# Altium project TS_24 Temperature Module.PrjPcb
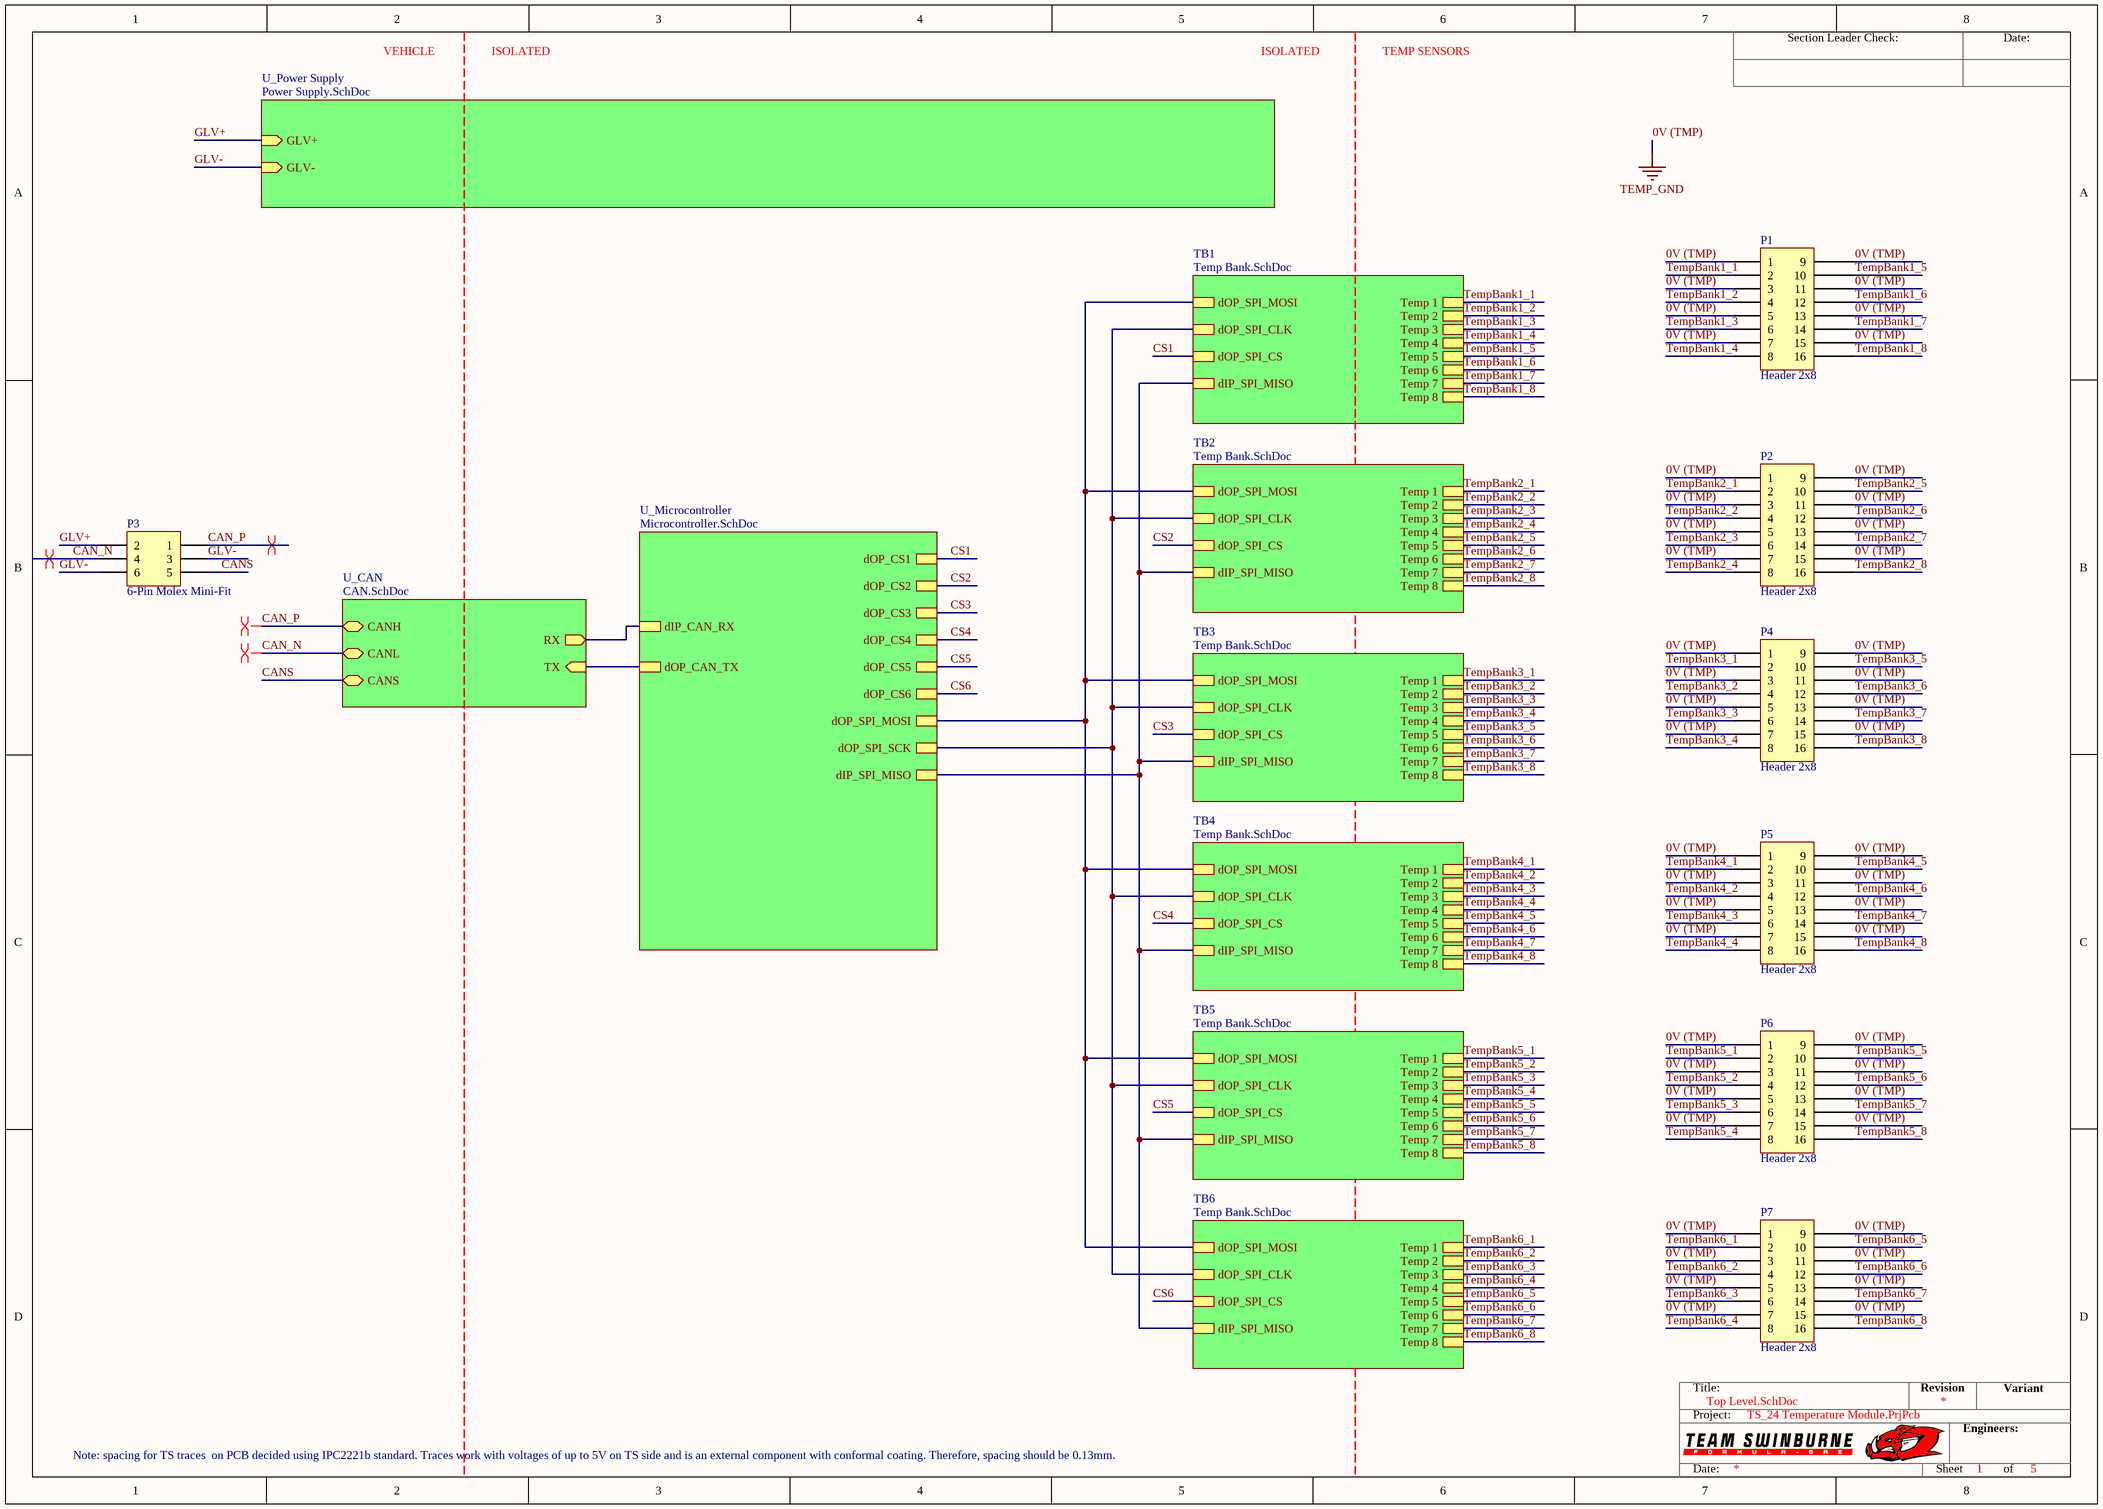
[diagram p0: Top Level.SchDoc]
5 sheets, 273 parts. Net scope: hierarchical (ports join the sheet entries above them; power ports are global).
Board file: Temp Module B1 Sample.PcbDoc
Sheets:
  Top Level.SchDoc
    U_Power Supply = Power Supply.SchDoc
    U_CAN = CAN.SchDoc
    U_Microcontroller = Microcontroller.SchDoc
    TB1 = Temp Bank.SchDoc
    TB2 = Temp Bank.SchDoc
    TB3 = Temp Bank.SchDoc
    TB4 = Temp Bank.SchDoc
    TB5 = Temp Bank.SchDoc
    TB6 = Temp Bank.SchDoc

## Sheet Top Level.SchDoc
size A3; SheetNumber: 1; SheetTotal: 5

### Parts
P1  Header 2x8  [B16B-PHDSS]
P2  Header 2x8  [B16B-PHDSS]
P3  6-Pin Molex Mini-Fit  [6-Pin Molex Mini-Fit]
P4  Header 2x8  [B16B-PHDSS]
P5  Header 2x8  [B16B-PHDSS]
P6  Header 2x8  [B16B-PHDSS]
P7  Header 2x8  [B16B-PHDSS]

### Sub-sheets
TB1 = Temp Bank.SchDoc: dOP_SPI_MOSI, dOP_SPI_CLK, dOP_SPI_CS, dIP_SPI_MISO, Temp 4, Temp 5, Temp 6, Temp 1, Temp 2, Temp 3, Temp 7, Temp 8
TB2 = Temp Bank.SchDoc: dOP_SPI_MOSI, dOP_SPI_CLK, dOP_SPI_CS, dIP_SPI_MISO, Temp 1, Temp 2, Temp 3, Temp 4, Temp 5, Temp 6, Temp 7, Temp 8
TB3 = Temp Bank.SchDoc: dOP_SPI_MOSI, dOP_SPI_CLK, dOP_SPI_CS, dIP_SPI_MISO, Temp 1, Temp 2, Temp 3, Temp 4, Temp 5, Temp 6, Temp 7, Temp 8
TB4 = Temp Bank.SchDoc: dOP_SPI_MOSI, dOP_SPI_CLK, dOP_SPI_CS, dIP_SPI_MISO, Temp 1, Temp 2, Temp 3, Temp 4, Temp 5, Temp 6, Temp 7, Temp 8
TB5 = Temp Bank.SchDoc: dOP_SPI_MOSI, dOP_SPI_CLK, dOP_SPI_CS, dIP_SPI_MISO, Temp 1, Temp 2, Temp 3, Temp 4, Temp 5, Temp 6, Temp 7, Temp 8
TB6 = Temp Bank.SchDoc: dOP_SPI_MOSI, dOP_SPI_CLK, dOP_SPI_CS, dIP_SPI_MISO, Temp 1, Temp 2, Temp 3, Temp 4, Temp 5, Temp 6, Temp 7, Temp 8
U_CAN = CAN.SchDoc: CANH (bidir), RX (out), TX (in), CANL (bidir), CANS (bidir)
U_Microcontroller = Microcontroller.SchDoc: dOP_CS1, dOP_CS2, dOP_CS3, dOP_CS4, dOP_CS5, dOP_SPI_MOSI, dOP_CS6, dOP_SPI_SCK, dIP_CAN_RX, dOP_CAN_TX, dIP_SPI_MISO
U_Power Supply = Power Supply.SchDoc: GLV+ (in), GLV- (in)

### Nets
0V (TMP): P1.1 P1.3 P1.5 P1.7 P1.9 P1.11 P1.13 P1.15 P2.1 P2.3 P2.5 P2.7 P2.9 P2.11 P2.13 P2.15 P4.1 P4.3 P4.5 P4.7 P4.9 P4.11 P4.13 P4.15 P5.1 P5.3 P5.5 P5.7 P5.9 P5.11 P5.13 P5.15 P6.1 P6.3 P6.5 P6.7 P6.9 P6.11 P6.13 P6.15 P7.1 P7.3 P7.5 P7.7 P7.9 P7.11 P7.13 P7.15  [also labelled TEMP_GND]
CAN_N: P3.4 ; sheet U_CAN/CANL
CAN_P: P3.1 ; sheet U_CAN/CANH
CANS: P3.5 ; sheet U_CAN/CANS
CS1: sheet U_Microcontroller/dOP_CS1, sheet TB1/dOP_SPI_CS
CS2: sheet U_Microcontroller/dOP_CS2, sheet TB2/dOP_SPI_CS
CS3: sheet U_Microcontroller/dOP_CS3, sheet TB3/dOP_SPI_CS
CS4: sheet U_Microcontroller/dOP_CS4, sheet TB4/dOP_SPI_CS
CS5: sheet U_Microcontroller/dOP_CS5, sheet TB5/dOP_SPI_CS
CS6: sheet U_Microcontroller/dOP_CS6, sheet TB6/dOP_SPI_CS
GLV+: P3.2 ; sheet U_Power Supply/GLV+
GLV-: P3.3 P3.6 ; sheet U_Power Supply/GLV-
TempBank1_1: P1.2 ; sheet TB1/Temp 1
TempBank1_2: P1.4 ; sheet TB1/Temp 2
TempBank1_3: P1.6 ; sheet TB1/Temp 3
TempBank1_4: P1.8 ; sheet TB1/Temp 4
TempBank1_5: P1.10 ; sheet TB1/Temp 5
TempBank1_6: P1.12 ; sheet TB1/Temp 6
TempBank1_7: P1.14 ; sheet TB1/Temp 7
TempBank1_8: P1.16 ; sheet TB1/Temp 8
TempBank2_1: P2.2 ; sheet TB2/Temp 1
TempBank2_2: P2.4 ; sheet TB2/Temp 2
TempBank2_3: P2.6 ; sheet TB2/Temp 3
TempBank2_4: P2.8 ; sheet TB2/Temp 4
TempBank2_5: P2.10 ; sheet TB2/Temp 5
TempBank2_6: P2.12 ; sheet TB2/Temp 6
TempBank2_7: P2.14 ; sheet TB2/Temp 7
TempBank2_8: P2.16 ; sheet TB2/Temp 8
TempBank3_1: P4.2 ; sheet TB3/Temp 1
TempBank3_2: P4.4 ; sheet TB3/Temp 2
TempBank3_3: P4.6 ; sheet TB3/Temp 3
TempBank3_4: P4.8 ; sheet TB3/Temp 4
TempBank3_5: P4.10 ; sheet TB3/Temp 5
TempBank3_6: P4.12 ; sheet TB3/Temp 6
TempBank3_7: P4.14 ; sheet TB3/Temp 7
TempBank3_8: P4.16 ; sheet TB3/Temp 8
TempBank4_1: P5.2 ; sheet TB4/Temp 1
TempBank4_2: P5.4 ; sheet TB4/Temp 2
TempBank4_3: P5.6 ; sheet TB4/Temp 3
TempBank4_4: P5.8 ; sheet TB4/Temp 4
TempBank4_5: P5.10 ; sheet TB4/Temp 5
TempBank4_6: P5.12 ; sheet TB4/Temp 6
TempBank4_7: P5.14 ; sheet TB4/Temp 7
TempBank4_8: P5.16 ; sheet TB4/Temp 8
TempBank5_1: P6.2 ; sheet TB5/Temp 1
TempBank5_2: P6.4 ; sheet TB5/Temp 2
TempBank5_3: P6.6 ; sheet TB5/Temp 3
TempBank5_4: P6.8 ; sheet TB5/Temp 4
TempBank5_5: P6.10 ; sheet TB5/Temp 5
TempBank5_6: P6.12 ; sheet TB5/Temp 6
TempBank5_7: P6.14 ; sheet TB5/Temp 7
TempBank5_8: P6.16 ; sheet TB5/Temp 8
TempBank6_1: P7.2 ; sheet TB6/Temp 1
TempBank6_2: P7.4 ; sheet TB6/Temp 2
TempBank6_3: P7.6 ; sheet TB6/Temp 3
TempBank6_4: P7.8 ; sheet TB6/Temp 4
TempBank6_5: P7.10 ; sheet TB6/Temp 5
TempBank6_6: P7.12 ; sheet TB6/Temp 6
TempBank6_7: P7.14 ; sheet TB6/Temp 7
TempBank6_8: P7.16 ; sheet TB6/Temp 8
NetD4_TB1_K: sheet U_Microcontroller/dIP_SPI_MISO, sheet TB1/dIP_SPI_MISO, sheet TB2/dIP_SPI_MISO, sheet TB3/dIP_SPI_MISO, sheet TB4/dIP_SPI_MISO, sheet TB5/dIP_SPI_MISO, sheet TB6/dIP_SPI_MISO
NetR2_2: sheet U_Microcontroller/dOP_SPI_MOSI, sheet TB1/dOP_SPI_MOSI, sheet TB2/dOP_SPI_MOSI, sheet TB3/dOP_SPI_MOSI, sheet TB4/dOP_SPI_MOSI, sheet TB5/dOP_SPI_MOSI, sheet TB6/dOP_SPI_MOSI
NetR4_2: sheet U_Microcontroller/dOP_SPI_SCK, sheet TB1/dOP_SPI_CLK, sheet TB2/dOP_SPI_CLK, sheet TB3/dOP_SPI_CLK, sheet TB4/dOP_SPI_CLK, sheet TB5/dOP_SPI_CLK, sheet TB6/dOP_SPI_CLK
NetR29_1: sheet U_CAN/RX, sheet U_Microcontroller/dIP_CAN_RX
NetR30_1: sheet U_CAN/TX, sheet U_Microcontroller/dOP_CAN_TX

### Layout directives
differential pair: CAN_N, CAN_P

### Notes on the sheet
- VEHICLE
- ISOLATED
- TEMP SENSORS
- Note: spacing for TS traces  on PCB decided using IPC2221b standard. Traces work with voltages of up to 5V on TS side and is an external component with conformal coating. Therefore, spacing should be 0.13mm.
- Section Leader Check:
- Date:
- Title:
- Revision
- Variant
- Project:
- Engineers:
- Sheet
- of

### Library data of the parts
P1 P2 P4-P7 = B16B-PHDSS: Positions: 16; Pitch: 2.00mm; Angle: 0; Flange: No; Contact: Tin; Part Number: B16B-PHDSS; Row Spacing: 2.00mm
P3 = CMP-CONN-0004-1: 6-Pin Molex Mini-Fit Connector Header 6 pin mini fit

## Sheet Power Supply.SchDoc
size A4; SheetNumber: 2; SheetTotal: 5
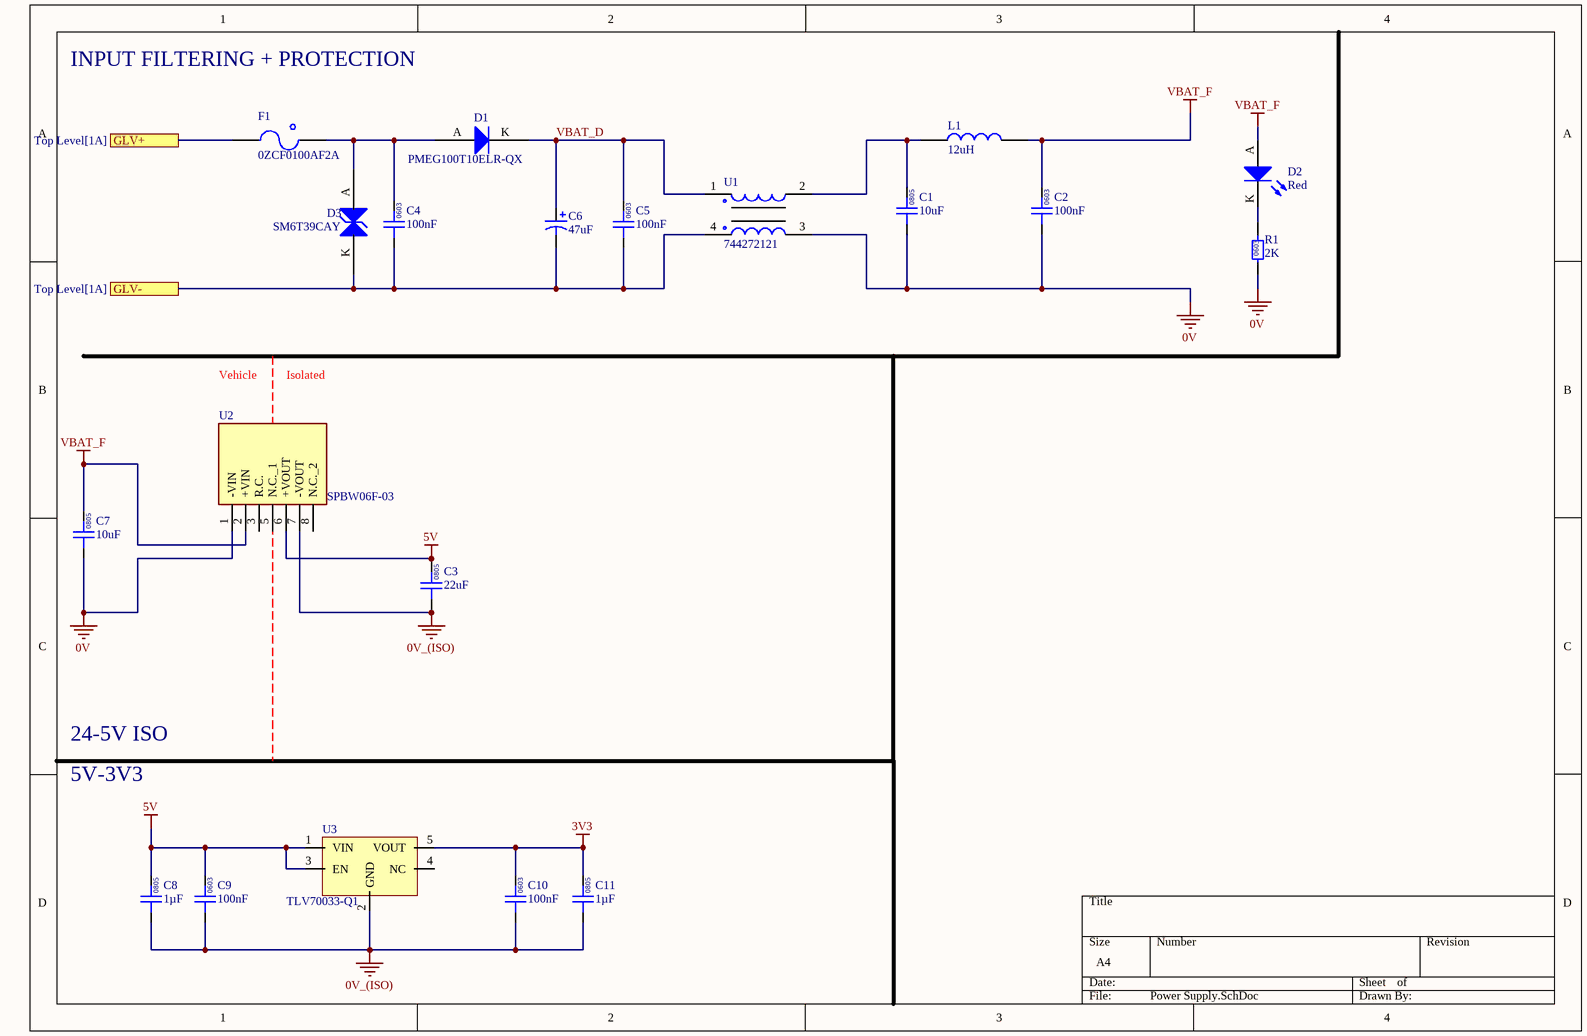
[diagram p1: Power Supply.SchDoc]

### Parts
C1  10uF  [0805]
C2  100nF  [0603]
C3  22uF  [0805]
C4  100nF  [0603]
C5  100nF  [0603]
C6  47uF  [CHEMI-CON ELCO]
C7  10uF  [0805]
C8  1µF  [0805]
C9  100nF  [0603]
C10  100nF  [0603]
C11  1µF  [0805]
D1  PMEG100T10ELR-QX  [SODFL350X110-2N]
D2  Red  [0805 LED]
D3  SM6T39CAY  [SM6T39CAY-Footprint-1]
F1  0ZCF0100AF2A  [2920]
L1  12uH  [1812]
R1  2K  [0603]
U1  744272121  [Wurth 4-PC Pad]
U2  SPBW06F-03  [SPBW06F03]
U3  TLV70033-Q1  [TI SOT-23-5]

### Ports
GLV+ (see Top Level[1A]), GLV- (see Top Level[1A])

### Nets
0V: C1.1 C2.1 C7.1 R1.1 U1.3 U2.1(-VIN)
0V_(ISO): C3.1 C8.1 C9.1 C10.1 C11.1 U2.7(-VOUT) U3.2(GND)
3V3: C10.2 C11.2 U3.5(VOUT)
5V: C3.2 C8.2 C9.2 U2.6(+VOUT) U3.1(VIN) U3.3(EN)
VBAT_F: C2.2 C7.2 D2.A L1.1 U2.2(+VIN)
GLV+: F1.1 ; port GLV+
GLV-: C4.1 C5.1 C6.1 D3.K U1.4 ; port GLV-
VBAT_D: C5.2 C6.2 D1.K U1.1
NetC1_2: C1.2 L1.2 U1.2
NetC4_2: C4.2 D1.A D3.A F1.2
NetD2_K: D2.K R1.2

Not connected (* = marked no-connect by the designer): U2 3(R.C.) 5(N.C._1) 8(N.C._2); U3 4(NC)

### Notes on the sheet
- INPUT FILTERING + PROTECTION
- Vehicle
- Isolated
- 24-5V ISO
- 5V-3V3
- (in symbol GCM21BR71H105KA03L) 0805
- (in symbol GCM188L81H104KA57D) 0603
- (in symbol GRM21BR6YA106KE43L) 0805
- (in symbol GRM21BR61A226ME51L) 0805
- (in symbol RC0603FR-072KL) 0603

### Library data of the parts
C1 C7 = GRM21BR6YA106KE43L: Manufacturer: muRata; Rated Voltage: 50V; Tolerance: 10%; Material: MLCC; Temperature Rating: X5R; Part Number: GRM21BR6YA106KE43L; Value: 10uF; Digikey Part Number: 490-10514-6-ND
C2 C4 C5 C9 C10 = GCM188L81H104KA57D: Manufacturer: muRata; Rated Voltage: 50V; Tolerance: ±10%; Material: MLCC; Temperature Rating: X8L; Part Number: GCM188L81H104KA57D; Value: 100nF; Digikey Part Number: 490-6049-1-ND
C3 = GRM21BR61A226ME51L: Manufacturer: muRata; Rated Voltage: 10V; Tolerance: 20%; Material: MLCC; Temperature Rating: X5R; Part Number: GRM21BR61A226ME51L; Value: 22uF; Digikey Part Number: 490-10511-1-ND
C6 = HHXA350ARA470MF61G: Part Number: HHXA350ARA470MF61G
C8 C11 = GCM21BR71H105KA03L: Manufacturer: muRata; Rated Voltage: 50V; Tolerance: ±10%; Material: MLCC; Temperature Rating: X7R; Part Number: GCM21BR71H105KA03L; Value: 1µF; Digikey Part Number: 490-10675-1-ND
D1 = CMP-004-00005-4: Diode 100 V 1A Surface Mount SOD-123W
D2 = SML-210LTT86: Red LED Indication - Discrete 1.75V 0805 (2012 Metric); Manufacturer: ROHM Semiconductor; Part Number: SML-210LTT86; Colour: Red; Digikey Part Number: 511-1286-1-ND
D3 = CMP-004-00003-4: TVS Diode Single Bi-Dir 33.3V 600W Automotive 2-Pin SMB T/R / TVS DIODE 33.3VWM 69.7VC SMB; Peak Pulse Current: 57A; Polarity: Bidirectional; Min Breakdown Voltage: 37.1V; Test Current: 1mA; Number of Elements: 1; Operating Supply Voltage: 30V; Diode Type: ZENER; Clamping Voltage: 53.9V; Leakage Current: 200nA; Power Line Protection: No; Max Surge Current: 11.1A; Max Breakdown Voltage: 41V; Breakdown Voltage: 39V; Max Power Dissipation: 600W; Radiation Hardening: No; Resistor Type: Zener; Termination: SMD/SMT; REACH SVHC: No SVHC; Reverse Breakdown Voltage: 37.1V; Max Operating Temperature: 150°C; Min Operating Temperature: -55°C; Element Configuration: Single; Length: 4.6mm; Case/Package: DO-214AA; Reverse Standoff Voltage: 33.3V; Number of Bidirectional Channels: 1; Number of Pins: 2; Direction: Bidirectional; Mount: Surface Mount; Package Quantity: 1; Width: 3.95mm; RoHS Compliant: Yes; Number of Channels: 1; Packaging: Tape and Reel; Max Reverse Leakage Current: 200nA; Peak Pulse Power: 600W; Height: 2.45mm; Series: Automotive, AEC-Q101, SM6TY, TRANSIL™
F1 = 0ZCF0100AF2A: PTC RESET FUSE 60V 1A 292; Manufacturer: Littelfuse Inc.; Part Number: 0ZCF0100AF2A; Digikey Part Number: 507-2070-1-ND; Digikey Link: https://www.digikey.com/product-detail/en/bel-fuse-inc/0ZCF0100AF2A/507-2070-1-ND/6210547
L1 = RLS-126: Manufacturer: Recom; Tolerance: 0.2; Impedance: 230mOhm; Rated Current: 0.8 A; Material: Wirewound; Part Number: RLS-126; Value: 12uH; Digikey Part Number: 945-3429-ND
R1 = RC0603FR-072KL: Manufacturer: YAGEO; Tolerance: 0.01; Rated Power: 0.1W; Part Number: RC0603FR-072KL; Value: 2K; Digikey Part Number: 311-2.00KHRCT-ND; Material: FR-07
U1 = 744272121: Manufacturer: Wurth Electronics Inc; Value: 120uH @ 100kHz; Impedance: 460 Ohms @ 30MHz; Rated Current: 2.5 A; Part Number: 744272121; Material: Wirewound; Digikey Part Number: 732-1489-1-ND
U2 = SPBW06F-03: Power Supply; Manufacturer_Name: Mean Well; Datasheet Link: https://www.arrow.com/en/products/spbw06f-03/mean-well-enterprises; Height: 11.1mm; Manufacturer_Part_Number: SPBW06F-03; Mouser Part Number: 709-SPBW06F-03; Mouser Price/Stock: https://www.mouser.co.uk/ProductDetail/MEAN-WELL/SPBW06F-03?qs=5aG0NVq1C4z4PI70qr7ycg%3D%3D; Arrow Part Number: SPBW06F-03; Arrow Price/Stock: https://www.arrow.com/en/products/spbw06f-03/mean-well-enterprises?region=nac
U3 = TLV70033-Q1: IC REG LINEAR 3.3V 200MA SOT23-5; Manufacturer: Texas Instruments; Input Voltage: 2 to 5.5 V; Output Current: 0.2 A; Part Number: TLV70033-Q1; Output Voltage: 3.3 V; Digikey Part Number: 296-27780-1-ND

## Sheet CAN.SchDoc
size A4; SheetNumber: 4; SheetTotal: 5
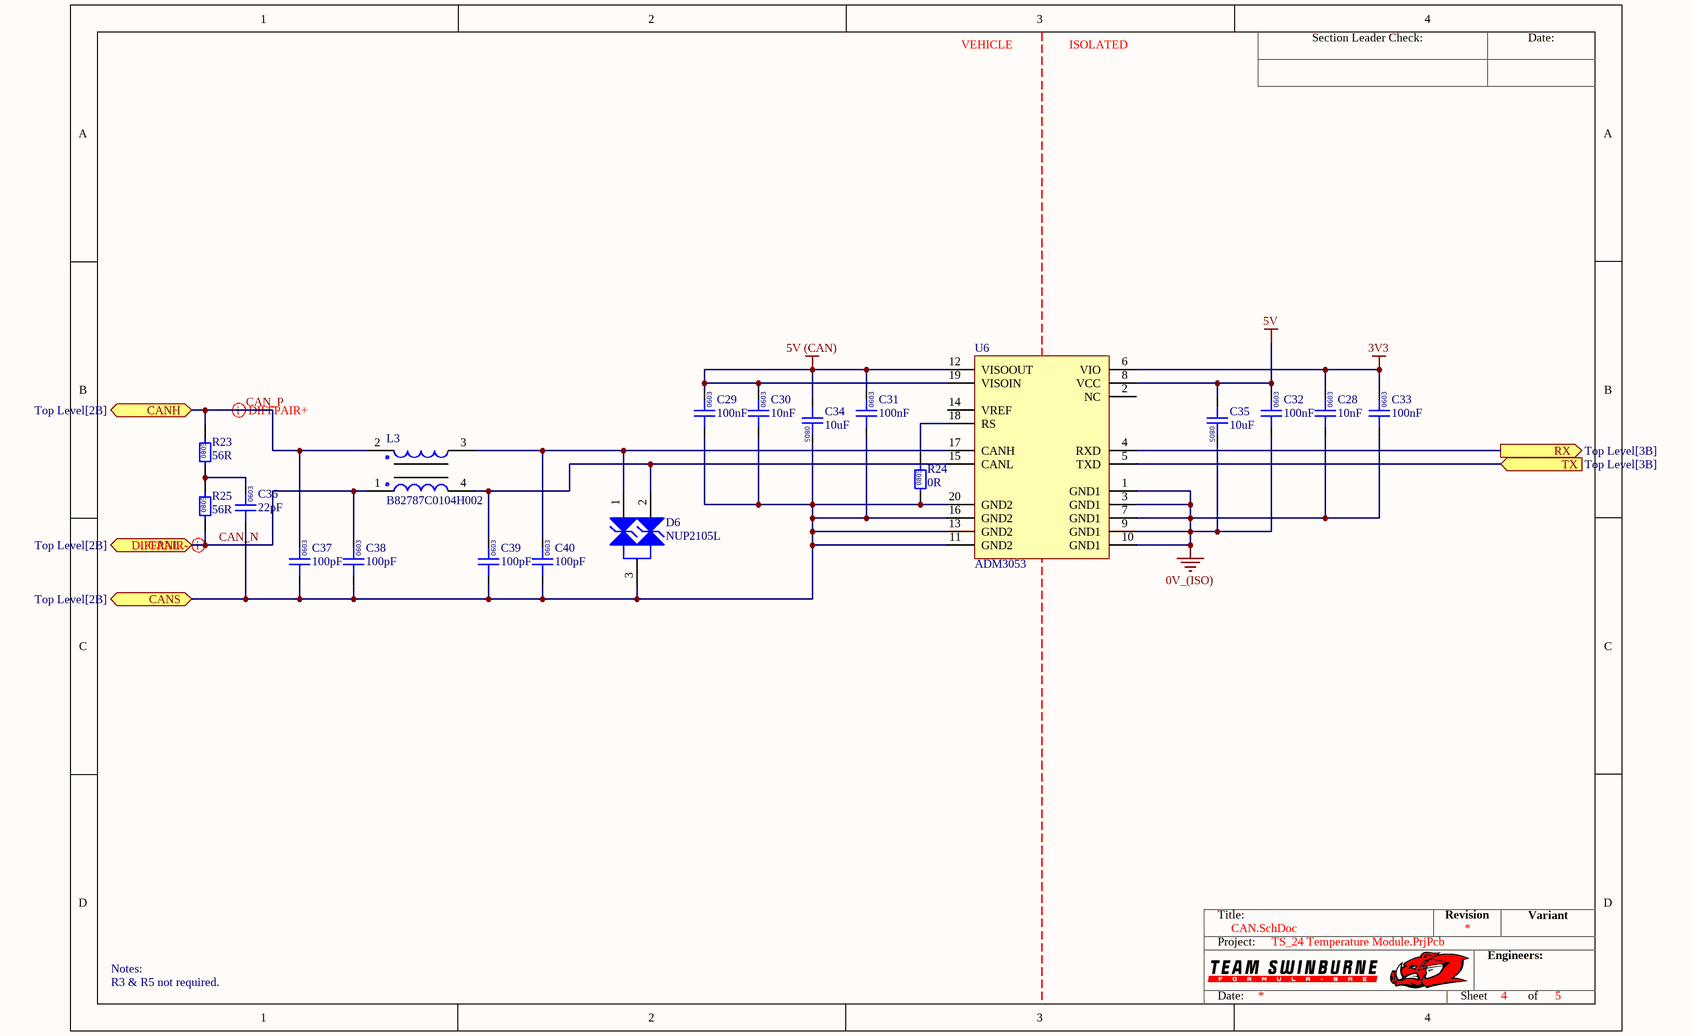
[diagram p2: CAN.SchDoc]

### Parts
C28  10nF  [0603]
C29  100nF  [0603]
C30  10nF  [0603]
C31  100nF  [0603]
C32  100nF  [0603]
C33  100nF  [0603]
C34  10uF  [0805]
C35  10uF  [0805]
C36  22pF  [0603]
C37  100pF  [0603]
C38  100pF  [0603]
C39  100pF  [0603]
C40  100pF  [0603]
D6  NUP2105L  [ONSC-SOT-23-3-318-08_V]
L3  B82787C0104H002  [TDK 4-PC Pad]
R23  56R  [0805]
R24  0R  [0805]
R25  56R  [0805]
U6  ADM3053  [AD SOIC-W 20]

### Ports
CANH (bidir, see Top Level[2B]), CANL (bidir, see Top Level[2B]), CANS (bidir, see Top Level[2B]), RX (out, see Top Level[3B]), TX (in, see Top Level[3B])

### Nets
0V_(ISO): C28.1 C32.1 C33.1 C35.2 U6.1(GND1) U6.3(GND1) U6.7(GND1) U6.9(GND1) U6.10(GND1)
3V3: C28.2 C33.2 U6.6(VIO)
5V: C32.2 C35.1 U6.8(VCC)
5V (CAN): C29.2 C30.2 C31.2 C34.1 U6.12(VISOOUT) U6.19(VISOIN)
CAN_N: C38.2 L3.1 R25.1 ; port CANL
CAN_P: C37.2 L3.2 R23.2 ; port CANH
CANS: C29.1 C30.1 C31.1 C34.2 C36.1 C37.1 C38.1 C39.1 C40.1 D6.3(K) R24.1 U6.11(GND2) U6.13(GND2) U6.16(GND2) U6.20(GND2) ; port CANS
NetC36_2: C36.2 R23.1 R25.2
NetC39_2: C39.2 D6.2(K) L3.4 U6.15(CANL)
NetC40_2: C40.2 D6.1(K) L3.3 U6.17(CANH)
NetR24_2: R24.2 U6.18(RS)
NetR29_1: U6.4(RXD) ; port RX
NetR30_1: U6.5(TXD) ; port TX

Not connected (* = marked no-connect by the designer): U6 2(NC) 14(VREF)

### Layout directives
differential pair: CAN_N, CAN_P

### Notes on the sheet
- VEHICLE
- ISOLATED
- Notes:
- R3 & R5 not required.
- Section Leader Check:
- Date:
- Title:
- Revision
- Variant
- Project:
- Engineers:
- Sheet
- of
- (in symbol GCM188L81H103KA03D) 0603
- (in symbol GCM188L81H104KA57D) 0603
- (in symbol GRM21BR6YA106KE43L) 0805
- (in symbol GRM0335C1H220JA01D) 0603
- (in symbol GRM1885C1H101JA01D) 0603
- (in symbol RC0805FR070RL) 0805
- (in symbol RC0805FR0756RL) 0805

### Library data of the parts
C28 C30 = GCM188L81H103KA03D: Manufacturer: muRata; Rated Voltage: 50V; Tolerance: ±10%; Material: MLCC; Temperature Rating: X8L; Part Number: GCM188L81H103KA03D; Value: 10nF; Digikey Part Number: 490-GCM188L81H103KA03DCT-ND
C29 C31-C33 = GCM188L81H104KA57D: as C2 on sheet Power Supply; Part Number: GCM188L81H104KA57D; Value: 100nF; Digikey Part Number: 490-6049-1-ND
C34 C35 = GRM21BR6YA106KE43L: as C1 on sheet Power Supply; Part Number: GRM21BR6YA106KE43L; Value: 10uF; Digikey Part Number: 490-10514-6-ND
C36 = GRM0335C1H220JA01D: Manufacturer: Murata Electronics; Rated Voltage: 50V; Tolerance: ±5%; Material: MLCC; Temperature Rating: C0G, NP0; Part Number: GRM0335C1H220JA01D; Value: 22pF; Digikey Part Number: 490-6123-1-ND
C37-C40 = GRM1885C1H101JA01D: Manufacturer: Murata Electronics; Rated Voltage: 50V; Tolerance: ±5%; Material: MLCC; Temperature Rating: C0G, NP0; Part Number: GRM1885C1H101JA01D; Value: 100pF; Digikey Part Number: 490-1427-1-ND
D6 = CMP-004-00000-1: NUP2105L Series 350 W Dual Line CAN Bus Protector ESD Protection Diode - SOT-23; Max Breakdown Voltage: 32V; Clamping Voltage: 44V; Number of Lines: 2; Direction: Bidirectional; Reverse Standoff Voltage: 24V; Min Breakdown Voltage: 26.2V; Peak Pulse Current: 8A; ESD Protection: Yes; Test Current: 1mA; Diode Type: ZENER; Max Power Dissipation: 350W; Capacitance: 30pF; Leakage Current: 100nA; Power Line Protection: No; Depth: 1.3mm; Package Quantity: 1; Element Configuration: Dual; Termination: SMD/SMT; Radiation Hardening: No; Min Operating Temperature: -55°C; Contact Plating: Tin,Matte; Packaging: Tape and Reel; Polarity: Bidirectional; Resistor Type: Zener; Clamping Voltage-Max: 44V; Height: 0.94mm; Max Surge Current: 8A; RoHS Compliant: Yes; Width: 1.3mm; Lead Free: Lead Free; Case/Package: SOT-23-3; Number of Channels: 2; Series: Automotive, AEC-Q101; Halogen Free: Halogen Free; Breakdown Voltage: 26.2V; Working Voltage: 24V; Operating Supply Voltage: 24V; Max Operating Temperature: 150°C; REACH SVHC: No SVHC; Number of Pins: 3; Max Reverse Leakage Current: 100nA; Peak Pulse Power: 350W; Length: 2.9mm; Number of Bidirectional Channels: 2
L3 = B82787C0104H002: Manufacturer: EPCOS (TDK); Value: 100µH @ 100kHz; Impedance: 5.8 kOhms @ 10MHz; Rated Current: 150mA; Material: Wirewound; Part Number: B82787C0104H002; Digikey Part Number: 495-4598-1-ND
R23 R25 = RC0805FR0756RL: Manufacturer: YAGEO; Tolerance: 0.01; Rated Power: 0.125W; Part Number: RC0805FR0756RL; Value: 56R; Material: FR-07; Digikey Part Number: 311-56.0CRCT-ND
R24 = RC0805FR070RL: Manufacturer: YAGEO; Tolerance: 0.01; Rated Power: 0.125W; Part Number: RC0805FR070RL; Value: 0R; Material: FR-07; Digikey Part Number: 311-0.0CRCT-ND
U6 = ADM3053: Isolated CAN Transceiver; Manufacturer: Analogue Devices; Part Number: ADM3053; Digikey Part Number: ADM3053BRWZ-ND; Digikey Link: https://www.digikey.com/product-detail/en/analog-devices-inc/ADM3053BRWZ/ADM3053BRWZ-ND/2709332

## Sheet Microcontroller.SchDoc
size A4; SheetNumber: 5; SheetTotal: 5
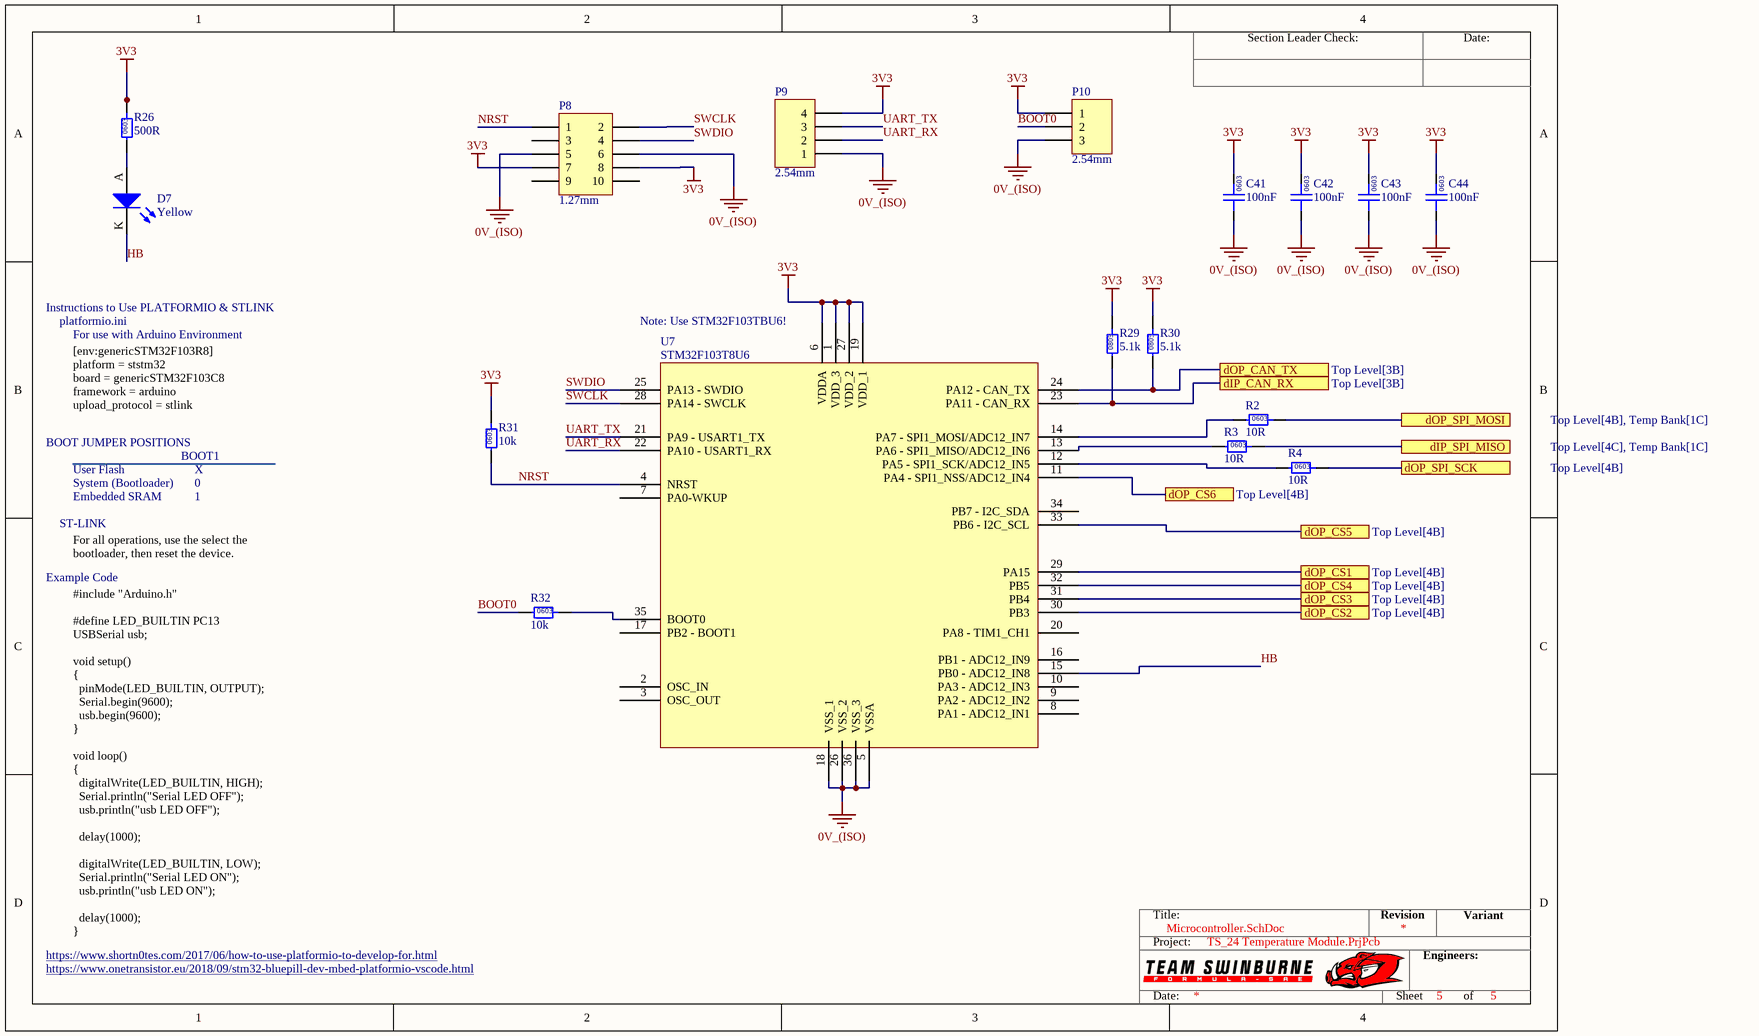
[diagram p3: Microcontroller.SchDoc]

### Parts
C41  100nF  [0603]
C42  100nF  [0603]
C43  100nF  [0603]
C44  100nF  [0603]
D7  Yellow  [0805 LED]
P8  1.27mm  [3221-10-0300-00]
P9  2.54mm  [TH 2.54mm Header 1x4]
P10  2.54mm  [TH 2.54mm Header 1x3]
R2  10R  [0603]
R3  10R  [0603]
R4  10R  [0603]
R26  500R  [0603]
R29  5.1k  [0805]
R30  5.1k  [0805]
R31  10k  [0603]
R32  10k  [0603]
U7  STM32F103T8U6  [STM_QFN-36]

### Ports
dIP_CAN_RX (see Top Level[3B]), dIP_SPI_MISO (see Top Level[4C], Temp Bank[1C]), dOP_CAN_TX (see Top Level[3B]), dOP_CS1 (see Top Level[4B]), dOP_CS2 (see Top Level[4B]), dOP_CS3 (see Top Level[4B]), dOP_CS4 (see Top Level[4B]), dOP_CS5 (see Top Level[4B]), dOP_CS6 (see Top Level[4B]), dOP_SPI_MOSI (see Top Level[4B], Temp Bank[1C]), dOP_SPI_SCK (see Top Level[4B])

### Nets
0V_(ISO): C41.1 C42.1 C43.1 C44.1 P8.5 P8.6 P9.1 P10.3 U7.5(VSSA) U7.18(VSS_1) U7.26(VSS_2) U7.36(VSS_3)
3V3: C41.2 C42.2 C43.2 C44.2 P8.7 P8.8 P9.4 P10.1 R26.2 R29.2 R30.2 R31.2 U7.1(VDD_3) U7.6(VDDA) U7.19(VDD_1) U7.27(VDD_2)
BOOT0: P10.2 R32.1
CS1: U7.29(PA15) ; port dOP_CS1
CS2: U7.30(PB3) ; port dOP_CS2
CS3: U7.31(PB4) ; port dOP_CS3
CS4: U7.32(PB5) ; port dOP_CS4
CS5: U7.33(PB6_-_I2C_SCL) ; port dOP_CS5
CS6: U7.11(PA4_-_SPI1_NSS/ADC12_IN4) ; port dOP_CS6
HB: D7.K U7.15(PB0_-_ADC12_IN8)
NRST: P8.1 R31.1 U7.4(NRST)
SWCLK: P8.2 U7.28(PA14_-_SWCLK)
SWDIO: P8.4 U7.25(PA13_-_SWDIO)
UART_RX: P9.2 U7.22(PA10_-_USART1_RX)
UART_TX: P9.3 U7.21(PA9_-_USART1_TX)
NetD4_TB1_K: R3.2 ; port dIP_SPI_MISO
NetD7_A: D7.A R26.1
NetR2_1: R2.1 U7.14(PA7_-_SPI1_MOSI/ADC12_IN7)
NetR2_2: R2.2 ; port dOP_SPI_MOSI
NetR3_1: R3.1 U7.13(PA6_-_SPI1_MISO/ADC12_IN6)
NetR4_1: R4.1 U7.12(PA5_-_SPI1_SCK/ADC12_IN5)
NetR4_2: R4.2 ; port dOP_SPI_SCK
NetR29_1: R29.1 U7.23(PA11_-_CAN_RX) ; port dIP_CAN_RX
NetR30_1: R30.1 U7.24(PA12_-_CAN_TX) ; port dOP_CAN_TX
NetR32_2: R32.2 U7.35(BOOT0)

Not connected (* = marked no-connect by the designer): P8 3 9 10; U7 2(OSC_IN) 3(OSC_OUT) 7(PA0-WKUP) 8(PA1_-_ADC12_IN1) 9(PA2_-_ADC12_IN2) 10(PA3_-_ADC12_IN3) 16(PB1_-_ADC12_IN9) 17(PB2_-_BOOT1_) 20(PA8_-_TIM1_CH1) 34(PB7_-_I2C_SDA)

### Notes on the sheet
- Instructions to Use PLATFORMIO & STLINK
- platformio.ini
- For use with Arduino Environment
- (near U7) Note: Use STM32F103TBU6!
- BOOT JUMPER POSITIONS
- [env:genericSTM32F103R8]
  platform = ststm32
  board = genericSTM32F103C8
  framework = arduino
  upload_protocol = stlink
- User Flash
- System (Bootloader)
- Embedded SRAM
- BOOT1
- X
- 1
- 0
- Example Code
- ST-LINK
- For all operations, use the select the bootloader, then reset the device.
- https://www.shortn0tes.com/2017/06/how-to-use-platformio-to-develop-for.html
- https://www.onetransistor.eu/2018/09/stm32-bluepill-dev-mbed-platformio-vscode.html
- #include "Arduino.h"
  #define LED_BUILTIN PC13
  USBSerial usb;
  void setup()
  {
  pinMode(LED_BUILTIN, OUTPUT);
  Serial.begin(9600);
  usb.begin(9600);
  }
  void loop()
  {
  digitalWrite(LED_BUILTIN, HIGH);
  Serial.println("Serial LED OFF");
  usb.println("usb LED OFF");
  delay(1000);
  digitalWrite(LED_BUILTIN, LOW);
  Serial.println("Serial LED ON");
  usb.println("usb LED ON");
  delay(1000);
  }
- Section Leader Check:
- Date:
- Title:
- Revision
- Variant
- Project:
- Engineers:
- Sheet
- of
- (in symbol GCM188L81H104KA57D) 0603
- (in symbol RC0603FR-0710KL) 0603
- (in symbol RC0603FR-0710RL) 0603
- (in symbol RC0805FR075K1L) 0805
- (in symbol RT0603BRD07500RL) 0603

### Library data of the parts
C41-C44 = GCM188L81H104KA57D: as C2 on sheet Power Supply; Part Number: GCM188L81H104KA57D; Value: 100nF; Digikey Part Number: 490-6049-1-ND
D7 = SML-211YTT86: Yellow LED Indication - Discrete 1.75V 0805 (2012 Metric); Manufacturer: ROHM Semiconductor; Part Number: SML-211YTT86; Colour: Yellow; Digikey Part Number: 511-1293-1-ND
P8 = SMD 1.27mm Header 2x5 (3221-10-0300-00): Positions: 10; Angle: 0; Flange: No; Contact: NA; Part Number: SMD 1.27mm Header 2x5 (3221-10-0300-00); Pitch: 1.27mm; Row Spacing: 1.27mm
P9 = TH 2.54mm Header 1x4: Positions: 4; Angle: 0; Flange: No; Contact: NA; Part Number: TH 2.54mm Header 1x4; Pitch: 2.54mm; Row Spacing: 2.54mm
P10 = TH 2.54mm Header 1x3: Positions: 3; Angle: 0; Flange: No; Contact: NA; Part Number: TH 2.54mm Header 1x3; Pitch: 2.54mm; Row Spacing: 2.54mm
R2-R4 = RC0603FR-0710RL: Manufacturer: YAGEO; Tolerance: 0.01; Rated Power: 0.1W; Part Number: RC0603FR-0710RL; Value: 10R; Material: FR-07; Digikey Part Number: 311-10.0HRCT-ND
R26 = RT0603BRD07500RL: Manufacturer: YAGEO; Tolerance: 0.01; Rated Power: 0.1W; Part Number: RT0603BRD07500RL; Value: 500R; Material: FR-07; Digikey Part Number: 13-RT0603BRD07500RL-ND
R29 R30 = RC0805FR075K1L: Manufacturer: YAGEO; Tolerance: 0.01; Rated Power: 0.125W; Part Number: RC0805FR075K1L; Value: 5.1k; Material: FR-07; Digikey Part Number: 311-5.10KCRCT-ND
R31 R32 = RC0603FR-0710KL: Manufacturer: YAGEO; Tolerance: 0.01; Rated Power: 0.1W; Part Number: RC0603FR-0710KL; Value: 10k; Digikey Part Number: 311-10.0KHRCT-ND; Material: FR-07
U7 = STM32F103T8U6: ARM® Cortex®-M3 STM32F1 Microcontroller IC 32-Bit 72MHz 64KB (64K x 8) FLASH QFN; Manufacturer: ST Microelectronics; Part Number: STM32F103T8U6; Digikey Part Number: STM32F103T8U6; Digikey Link: https://www.digikey.com/en/products/detail/stmicroelectronics/stm32f103t8u6/1852493

## Sheet Temp Bank.SchDoc
size A4; SheetNumber: 3; SheetTotal: 5
Used 6 times, as channels TB1, TB2, TB3, TB4, TB5, TB6. Parts and nets are listed once, with the designators drawn on the sheet.
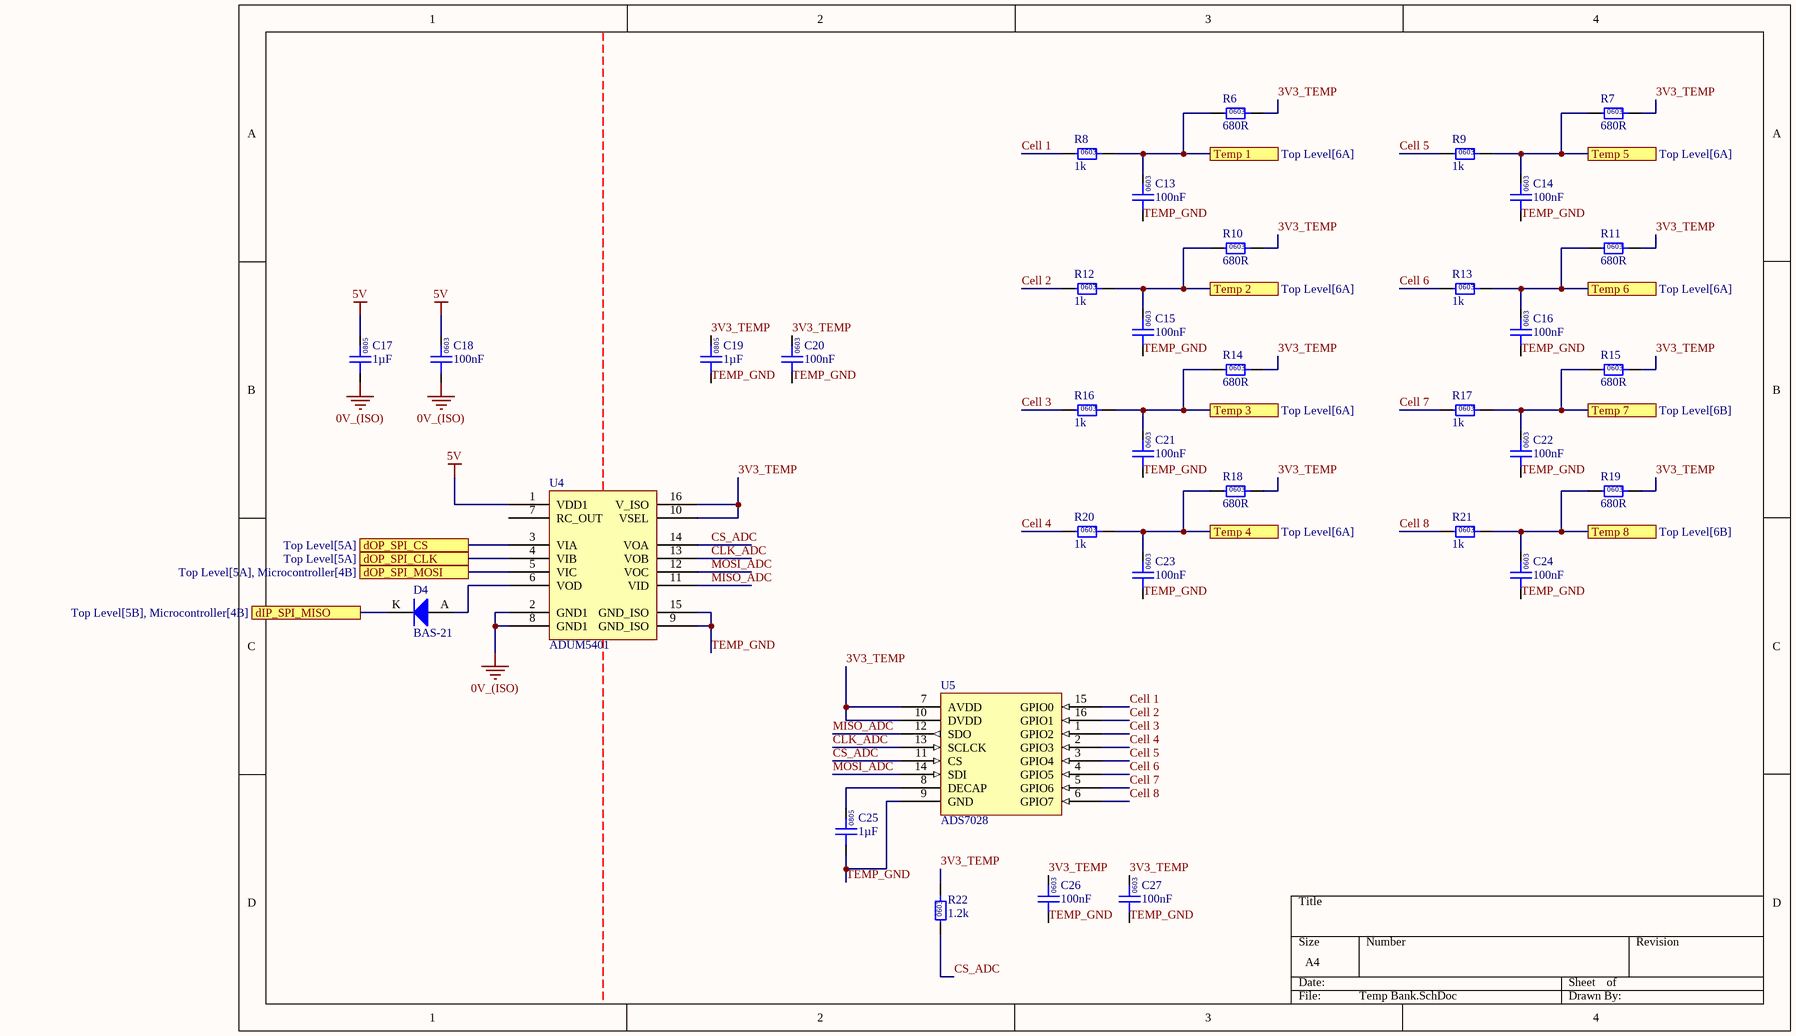
[diagram p4: Temp Bank.SchDoc]

### Parts
C13  100nF  [0603]
C14  100nF  [0603]
C15  100nF  [0603]
C16  100nF  [0603]
C17  1µF  [0805]
C18  100nF  [0603]
C19  1µF  [0805]
C20  100nF  [0603]
C21  100nF  [0603]
C22  100nF  [0603]
C23  100nF  [0603]
C24  100nF  [0603]
C25  1µF  [0805]
C26  100nF  [0603]
C27  100nF  [0603]
D4  BAS-21  [NEXPERIA_SOT23]
R6  680R  [0603]
R7  680R  [0603]
R8  1k  [0603]
R9  1k  [0603]
R10  680R  [0603]
R11  680R  [0603]
R12  1k  [0603]
R13  1k  [0603]
R14  680R  [0603]
R15  680R  [0603]
R16  1k  [0603]
R17  1k  [0603]
R18  680R  [0603]
R19  680R  [0603]
R20  1k  [0603]
R21  1k  [0603]
R22  1.2k  [0603]
U4  ADUM5401  [AD 16-SOIC]
U5  ADS7028  [WFQN-16]

### Ports
dIP_SPI_MISO (see Top Level[5B], Microcontroller[4B]), dOP_SPI_CLK (see Top Level[5A]), dOP_SPI_CS (see Top Level[5A]), dOP_SPI_MOSI (see Top Level[5A], Microcontroller[4B]), Temp 1 (see Top Level[6A]), Temp 2 (see Top Level[6A]), Temp 3 (see Top Level[6A]), Temp 4 (see Top Level[6A]), Temp 5 (see Top Level[6A]), Temp 6 (see Top Level[6A]), Temp 7 (see Top Level[6B]), Temp 8 (see Top Level[6B])

### Nets
0V_(ISO): C17.1 C18.1 U4.2(GND1) U4.8(GND1)
5V: C17.2 C18.2 U4.1(VDD1)
3V3_TEMP: C19.2 C20.2 C26.2 C27.2 R6.2 R7.2 R10.2 R11.2 R14.2 R15.2 R18.2 R19.2 R22.2 U4.10(VSEL) U4.16(V_ISO) U5.7(AVDD) U5.10(DVDD)
Cell 1: R8.1 U5.15(GPIO0)
Cell 2: R12.1 U5.16(GPIO1)
Cell 3: R16.1 U5.1(GPIO2)
Cell 4: R20.1 U5.2(GPIO3)
Cell 5: R9.1 U5.3(GPIO4)
Cell 6: R13.1 U5.4(GPIO5)
Cell 7: R17.1 U5.5(GPIO6)
Cell 8: R21.1 U5.6(GPIO7)
CLK_ADC: U4.13(VOB) U5.13(SCLCK)
CS_ADC: R22.1 U4.14(VOA) U5.11(CS)
dIP_SPI_MISO: D4.K ; port dIP_SPI_MISO
dOP_SPI_CLK: U4.4(VIB) ; port dOP_SPI_CLK
dOP_SPI_CS: U4.3(VIA) ; port dOP_SPI_CS
dOP_SPI_MOSI: U4.5(VIC) ; port dOP_SPI_MOSI
MISO_ADC: U4.11(VID) U5.12(SDO)
MOSI_ADC: U4.12(VOC) U5.14(SDI)
Temp 1: C13.2 R6.1 R8.2 ; port Temp 1
Temp 2: C15.2 R10.1 R12.2 ; port Temp 2
Temp 3: C21.2 R14.1 R16.2 ; port Temp 3
Temp 4: C23.2 R18.1 R20.2 ; port Temp 4
Temp 5: C14.2 R7.1 R9.2 ; port Temp 5
Temp 6: C16.2 R11.1 R13.2 ; port Temp 6
Temp 7: C22.2 R15.1 R17.2 ; port Temp 7
Temp 8: C24.2 R19.1 R21.2 ; port Temp 8
TEMP_GND: C13.1 C14.1 C15.1 C16.1 C19.1 C20.1 C21.1 C22.1 C23.1 C24.1 C25.1 C26.1 C27.1 U4.9(GND_ISO) U4.15(GND_ISO) U5.9(GND)
NetC25_2: C25.2 U5.8(DECAP)
NetD4_A: D4.A U4.6(VOD)

Not connected (* = marked no-connect by the designer): U4 7(RC_OUT)

### Channels
TB1: designators end in _TB1; ports dIP_SPI_MISO=NetD4_TB1_K dOP_SPI_CLK=NetR4_2 dOP_SPI_CS=CS1 dOP_SPI_MOSI=NetR2_2 Temp 1=TempBank1_1 Temp 2=TempBank1_2 Temp 3=TempBank1_3 Temp 4=TempBank1_4 Temp 5=TempBank1_5 Temp 6=TempBank1_6 Temp 7=TempBank1_7 Temp 8=TempBank1_8
TB2: designators end in _TB2; ports dIP_SPI_MISO=NetD4_TB1_K dOP_SPI_CLK=NetR4_2 dOP_SPI_CS=CS2 dOP_SPI_MOSI=NetR2_2 Temp 1=TempBank2_1 Temp 2=TempBank2_2 Temp 3=TempBank2_3 Temp 4=TempBank2_4 Temp 5=TempBank2_5 Temp 6=TempBank2_6 Temp 7=TempBank2_7 Temp 8=TempBank2_8
TB3: designators end in _TB3; ports dIP_SPI_MISO=NetD4_TB1_K dOP_SPI_CLK=NetR4_2 dOP_SPI_CS=CS3 dOP_SPI_MOSI=NetR2_2 Temp 1=TempBank3_1 Temp 2=TempBank3_2 Temp 3=TempBank3_3 Temp 4=TempBank3_4 Temp 5=TempBank3_5 Temp 6=TempBank3_6 Temp 7=TempBank3_7 Temp 8=TempBank3_8
TB4: designators end in _TB4; ports dIP_SPI_MISO=NetD4_TB1_K dOP_SPI_CLK=NetR4_2 dOP_SPI_CS=CS4 dOP_SPI_MOSI=NetR2_2 Temp 1=TempBank4_1 Temp 2=TempBank4_2 Temp 3=TempBank4_3 Temp 4=TempBank4_4 Temp 5=TempBank4_5 Temp 6=TempBank4_6 Temp 7=TempBank4_7 Temp 8=TempBank4_8
TB5: designators end in _TB5; ports dIP_SPI_MISO=NetD4_TB1_K dOP_SPI_CLK=NetR4_2 dOP_SPI_CS=CS5 dOP_SPI_MOSI=NetR2_2 Temp 1=TempBank5_1 Temp 2=TempBank5_2 Temp 3=TempBank5_3 Temp 4=TempBank5_4 Temp 5=TempBank5_5 Temp 6=TempBank5_6 Temp 7=TempBank5_7 Temp 8=TempBank5_8
TB6: designators end in _TB6; ports dIP_SPI_MISO=NetD4_TB1_K dOP_SPI_CLK=NetR4_2 dOP_SPI_CS=CS6 dOP_SPI_MOSI=NetR2_2 Temp 1=TempBank6_1 Temp 2=TempBank6_2 Temp 3=TempBank6_3 Temp 4=TempBank6_4 Temp 5=TempBank6_5 Temp 6=TempBank6_6 Temp 7=TempBank6_7 Temp 8=TempBank6_8

### Notes on the sheet
- (in symbol GCM21BR71H105KA03L) 0805
- (in symbol GCM188L81H104KA57D) 0603
- (in symbol RC0603FR-071KL) 0603
- (in symbol RC0603JR-071K2L) 0603
- (in symbol RC0603JR-13680RL) 0603

### Library data of the parts
C13-C16 C18 C20-C24 C26 C27 = GCM188L81H104KA57D: as C2 on sheet Power Supply; Part Number: GCM188L81H104KA57D; Value: 100nF; Digikey Part Number: 490-6049-1-ND
C17 C19 C25 = GCM21BR71H105KA03L: as C8 on sheet Power Supply; Part Number: GCM21BR71H105KA03L; Value: 1µF; Digikey Part Number: 490-10675-1-ND
D4 = BAS-21: Manufacturer: Nexperia USA Inc.; Forward Voltage: 1.0V; Breakdown Voltage: 250V; Rated Power: 250mW; Part Number: BAS-21
R6 R7 R10 R11 R14 R15 R18 R19 = RC0603JR-13680RL: Manufacturer: YAGEO; Tolerance: 0.01; Rated Power: 0.1W; Part Number: RC0603JR-13680RL; Value: 680R; Material: FR-07; Digikey Part Number: 13-RC0603JR-13680RLCT-ND
R8 R9 R12 R13 R16 R17 R20 R21 = RC0603FR-071KL: Manufacturer: YAGEO; Tolerance: 0.01; Rated Power: 0.1W; Part Number: RC0603FR-071KL; Value: 1k; Material: FR-07; Digikey Part Number: 311-1.00KHRCT-ND
R22 = RC0603JR-071K2L: Manufacturer: YAGEO; Tolerance: 0.01; Rated Power: 0.1W; Part Number: RC0603JR-071K2L; Value: 1.2k; Material: FR-07; Digikey Part Number: 311-1.2KGRCT-ND
U4 = ADUM5401: Quad Channel 2.5kV Digital Isolator with isoPower; Manufacturer: Analogue Devices; Part Number: ADUM5401
U5 = ADS7028IRTER: IC ADC 12BIT SAR 16WQFN; Manufacturer: Texas Instruments; Part Number: ADS7028IRTER; Digikey Part Number: ADS7028IRTER; Digikey Link: https://www.digikey.com.au/en/products/detail/texas-instruments/ADS7028IRTER/12696020?s=N4IgTCBcDaIIIBEDKB2ADGAHASQEoBUBRXEAXQF8g

## Nets that join several sheets
0V_(ISO): Power Supply (7 pins), CAN (9 pins), Microcontroller (12 pins), TB1 (C17_TB1.1 C18_TB1.1 U4_TB1.2 U4_TB1.8), TB2 (C17_TB2.1 C18_TB2.1 U4_TB2.2 U4_TB2.8), TB3 (C17_TB3.1 C18_TB3.1 U4_TB3.2 U4_TB3.8), TB4 (C17_TB4.1 C18_TB4.1 U4_TB4.2 U4_TB4.8), TB5 (C17_TB5.1 C18_TB5.1 U4_TB5.2 U4_TB5.8), TB6 (C17_TB6.1 C18_TB6.1 U4_TB6.2 U4_TB6.8)
3V3: Power Supply (C10.2 C11.2 U3.5), CAN (C28.2 C33.2 U6.6), Microcontroller (16 pins)
5V: Power Supply (6 pins), CAN (C32.2 C35.1 U6.8), TB1 (C17_TB1.2 C18_TB1.2 U4_TB1.1), TB2 (C17_TB2.2 C18_TB2.2 U4_TB2.1), TB3 (C17_TB3.2 C18_TB3.2 U4_TB3.1), TB4 (C17_TB4.2 C18_TB4.2 U4_TB4.1), TB5 (C17_TB5.2 C18_TB5.2 U4_TB5.1), TB6 (C17_TB6.2 C18_TB6.2 U4_TB6.1)
CAN_N: Top Level (P3.4), CAN (C38.2 L3.1 R25.1)
CAN_P: Top Level (P3.1), CAN (C37.2 L3.2 R23.2)
CANS: Top Level (P3.5), CAN (15 pins)
CS1: Microcontroller (U7.29), TB1 (U4_TB1.3)
CS2: Microcontroller (U7.30), TB2 (U4_TB2.3)
CS3: Microcontroller (U7.31), TB3 (U4_TB3.3)
CS4: Microcontroller (U7.32), TB4 (U4_TB4.3)
CS5: Microcontroller (U7.33), TB5 (U4_TB5.3)
CS6: Microcontroller (U7.11), TB6 (U4_TB6.3)
GLV+: Top Level (P3.2), Power Supply (F1.1)
GLV-: Top Level (P3.3 P3.6), Power Supply (5 pins)
NetD4_TB1_K: Microcontroller (R3.2), TB1 (D4_TB1.K), TB2 (D4_TB2.K), TB3 (D4_TB3.K), TB4 (D4_TB4.K), TB5 (D4_TB5.K), TB6 (D4_TB6.K)
NetR2_2: Microcontroller (R2.2), TB1 (U4_TB1.5), TB2 (U4_TB2.5), TB3 (U4_TB3.5), TB4 (U4_TB4.5), TB5 (U4_TB5.5), TB6 (U4_TB6.5)
NetR4_2: Microcontroller (R4.2), TB1 (U4_TB1.4), TB2 (U4_TB2.4), TB3 (U4_TB3.4), TB4 (U4_TB4.4), TB5 (U4_TB5.4), TB6 (U4_TB6.4)
NetR29_1: CAN (U6.4), Microcontroller (R29.1 U7.23)
NetR30_1: CAN (U6.5), Microcontroller (R30.1 U7.24)
TempBank1_1: Top Level (P1.2), TB1 (C13_TB1.2 R6_TB1.1 R8_TB1.2)
TempBank1_2: Top Level (P1.4), TB1 (C15_TB1.2 R10_TB1.1 R12_TB1.2)
TempBank1_3: Top Level (P1.6), TB1 (C21_TB1.2 R14_TB1.1 R16_TB1.2)
TempBank1_4: Top Level (P1.8), TB1 (C23_TB1.2 R18_TB1.1 R20_TB1.2)
TempBank1_5: Top Level (P1.10), TB1 (C14_TB1.2 R7_TB1.1 R9_TB1.2)
TempBank1_6: Top Level (P1.12), TB1 (C16_TB1.2 R11_TB1.1 R13_TB1.2)
TempBank1_7: Top Level (P1.14), TB1 (C22_TB1.2 R15_TB1.1 R17_TB1.2)
TempBank1_8: Top Level (P1.16), TB1 (C24_TB1.2 R19_TB1.1 R21_TB1.2)
TempBank2_1: Top Level (P2.2), TB2 (C13_TB2.2 R6_TB2.1 R8_TB2.2)
TempBank2_2: Top Level (P2.4), TB2 (C15_TB2.2 R10_TB2.1 R12_TB2.2)
TempBank2_3: Top Level (P2.6), TB2 (C21_TB2.2 R14_TB2.1 R16_TB2.2)
TempBank2_4: Top Level (P2.8), TB2 (C23_TB2.2 R18_TB2.1 R20_TB2.2)
TempBank2_5: Top Level (P2.10), TB2 (C14_TB2.2 R7_TB2.1 R9_TB2.2)
TempBank2_6: Top Level (P2.12), TB2 (C16_TB2.2 R11_TB2.1 R13_TB2.2)
TempBank2_7: Top Level (P2.14), TB2 (C22_TB2.2 R15_TB2.1 R17_TB2.2)
TempBank2_8: Top Level (P2.16), TB2 (C24_TB2.2 R19_TB2.1 R21_TB2.2)
TempBank3_1: Top Level (P4.2), TB3 (C13_TB3.2 R6_TB3.1 R8_TB3.2)
TempBank3_2: Top Level (P4.4), TB3 (C15_TB3.2 R10_TB3.1 R12_TB3.2)
TempBank3_3: Top Level (P4.6), TB3 (C21_TB3.2 R14_TB3.1 R16_TB3.2)
TempBank3_4: Top Level (P4.8), TB3 (C23_TB3.2 R18_TB3.1 R20_TB3.2)
TempBank3_5: Top Level (P4.10), TB3 (C14_TB3.2 R7_TB3.1 R9_TB3.2)
TempBank3_6: Top Level (P4.12), TB3 (C16_TB3.2 R11_TB3.1 R13_TB3.2)
TempBank3_7: Top Level (P4.14), TB3 (C22_TB3.2 R15_TB3.1 R17_TB3.2)
TempBank3_8: Top Level (P4.16), TB3 (C24_TB3.2 R19_TB3.1 R21_TB3.2)
TempBank4_1: Top Level (P5.2), TB4 (C13_TB4.2 R6_TB4.1 R8_TB4.2)
TempBank4_2: Top Level (P5.4), TB4 (C15_TB4.2 R10_TB4.1 R12_TB4.2)
TempBank4_3: Top Level (P5.6), TB4 (C21_TB4.2 R14_TB4.1 R16_TB4.2)
TempBank4_4: Top Level (P5.8), TB4 (C23_TB4.2 R18_TB4.1 R20_TB4.2)
TempBank4_5: Top Level (P5.10), TB4 (C14_TB4.2 R7_TB4.1 R9_TB4.2)
TempBank4_6: Top Level (P5.12), TB4 (C16_TB4.2 R11_TB4.1 R13_TB4.2)
TempBank4_7: Top Level (P5.14), TB4 (C22_TB4.2 R15_TB4.1 R17_TB4.2)
TempBank4_8: Top Level (P5.16), TB4 (C24_TB4.2 R19_TB4.1 R21_TB4.2)
TempBank5_1: Top Level (P6.2), TB5 (C13_TB5.2 R6_TB5.1 R8_TB5.2)
TempBank5_2: Top Level (P6.4), TB5 (C15_TB5.2 R10_TB5.1 R12_TB5.2)
TempBank5_3: Top Level (P6.6), TB5 (C21_TB5.2 R14_TB5.1 R16_TB5.2)
TempBank5_4: Top Level (P6.8), TB5 (C23_TB5.2 R18_TB5.1 R20_TB5.2)
TempBank5_5: Top Level (P6.10), TB5 (C14_TB5.2 R7_TB5.1 R9_TB5.2)
TempBank5_6: Top Level (P6.12), TB5 (C16_TB5.2 R11_TB5.1 R13_TB5.2)
TempBank5_7: Top Level (P6.14), TB5 (C22_TB5.2 R15_TB5.1 R17_TB5.2)
TempBank5_8: Top Level (P6.16), TB5 (C24_TB5.2 R19_TB5.1 R21_TB5.2)
TempBank6_1: Top Level (P7.2), TB6 (C13_TB6.2 R6_TB6.1 R8_TB6.2)
TempBank6_2: Top Level (P7.4), TB6 (C15_TB6.2 R10_TB6.1 R12_TB6.2)
TempBank6_3: Top Level (P7.6), TB6 (C21_TB6.2 R14_TB6.1 R16_TB6.2)
TempBank6_4: Top Level (P7.8), TB6 (C23_TB6.2 R18_TB6.1 R20_TB6.2)
TempBank6_5: Top Level (P7.10), TB6 (C14_TB6.2 R7_TB6.1 R9_TB6.2)
TempBank6_6: Top Level (P7.12), TB6 (C16_TB6.2 R11_TB6.1 R13_TB6.2)
TempBank6_7: Top Level (P7.14), TB6 (C22_TB6.2 R15_TB6.1 R17_TB6.2)
TempBank6_8: Top Level (P7.16), TB6 (C24_TB6.2 R19_TB6.1 R21_TB6.2)